# EAGLE design PDU_Meanwell_LRS (EAGLE 9.6.2)
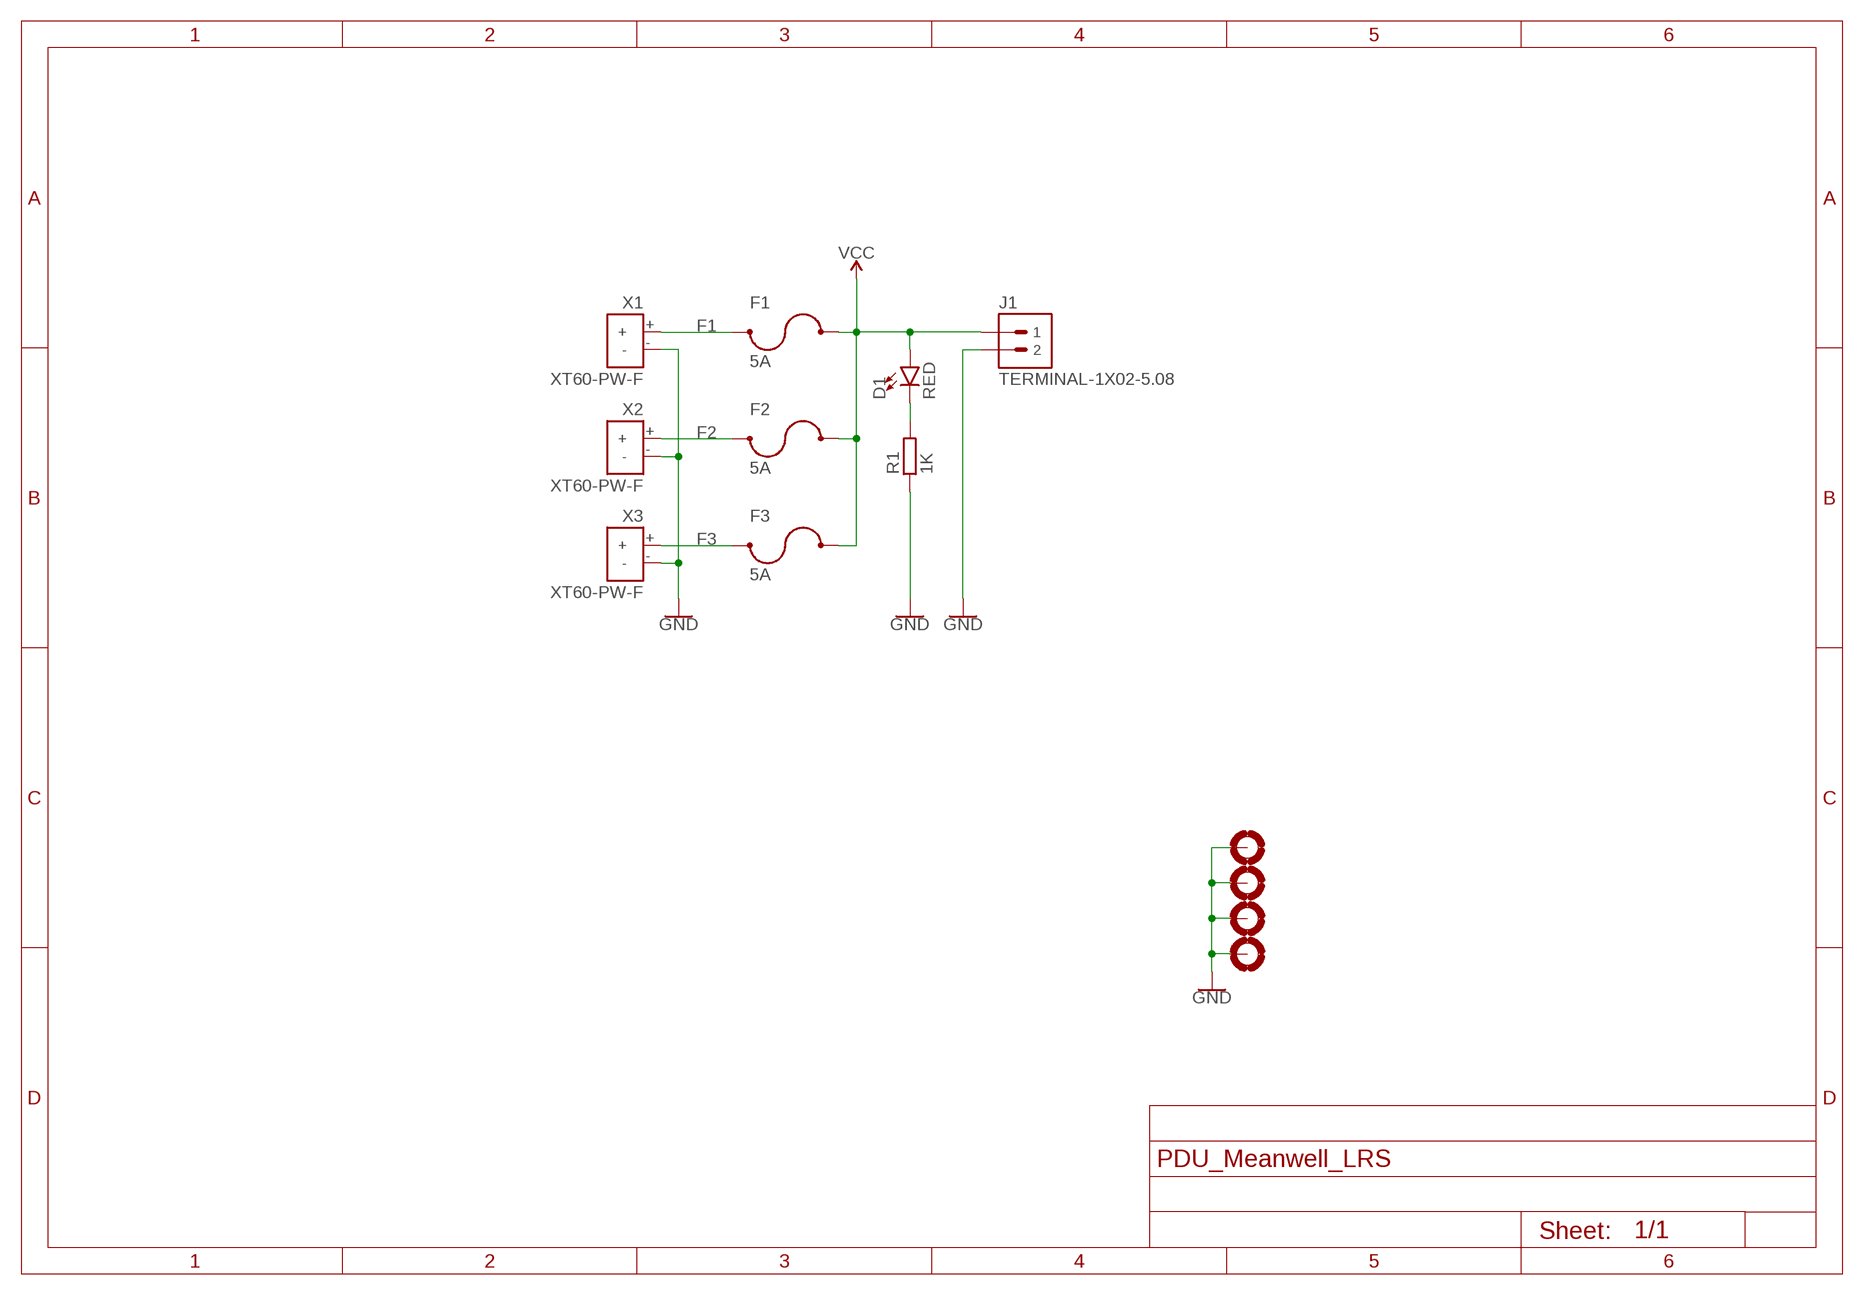
[diagram p0: schematic, sheet 1]

## Parts
D1  RED  LED5MM  [LED5MM]
F1  5A  FUSE-HOLDERCAR-MEDIUM  [CAR-FUSE-MEDIUM]
F2  5A  FUSE-HOLDERCAR-MEDIUM  [CAR-FUSE-MEDIUM]
F3  5A  FUSE-HOLDERCAR-MEDIUM  [CAR-FUSE-MEDIUM]
H1  MOUNTHOLE-PAD3.2  [3.2-PAD]
H2  MOUNTHOLE-PAD3.2  [3.2-PAD]
H3  MOUNTHOLE-PAD3.2  [3.2-PAD]
H4  MOUNTHOLE-PAD3.2  [3.2-PAD]
J1  TERMINAL-1X02-5.08  [TERMINAL-5.08-2P]
R1  1K  RESISTOR0603  [R0603]
X1  XT60-PW-F  [XT60-PW-F]
X2  XT60-PW-F  [XT60-PW-F]
X3  XT60-PW-F  [XT60-PW-F]

## Nets
F1: F1.1@1 F1.1@2 X1.+
F2: F2.1@1 F2.1@2 X2.+
F3: F3.1@1 F3.1@2 X3.+
GND: H1.B3,2(MOUNT) H2.B3,2(MOUNT) H3.B3,2(MOUNT) H4.B3,2(MOUNT) J1.P$2 R1.1 X1.- X2.- X3.-
N$3: D1.K(C) R1.2
VCC: D1.A F1.2@3 F1.2@4 F2.2@3 F2.2@4 F3.2@3 F3.2@4 J1.P$1

## Library data of the parts
D1 = M2M-LED:LED: LED (Generic) Standard schematic elements and footprints for 5mm, 3mm, 1206, and 0603 sized LEDs. Generic LEDs with no color specified.
F1-F3 = M2M-Fuse:FUSE-HOLDER
H1-H4 = M2M-Holes:MOUNTHOLE-PAD
J1 = M2M-Connectors:TERMINAL-1X02-5.08: https://www.digikey.se/product-detail/sv/on-shore-technology-inc/OSTTC022162/ED2609-ND/614558
R1 = M2M-Passives:RESISTOR
X1-X3 = M2M-Connectors:XT60

## Board
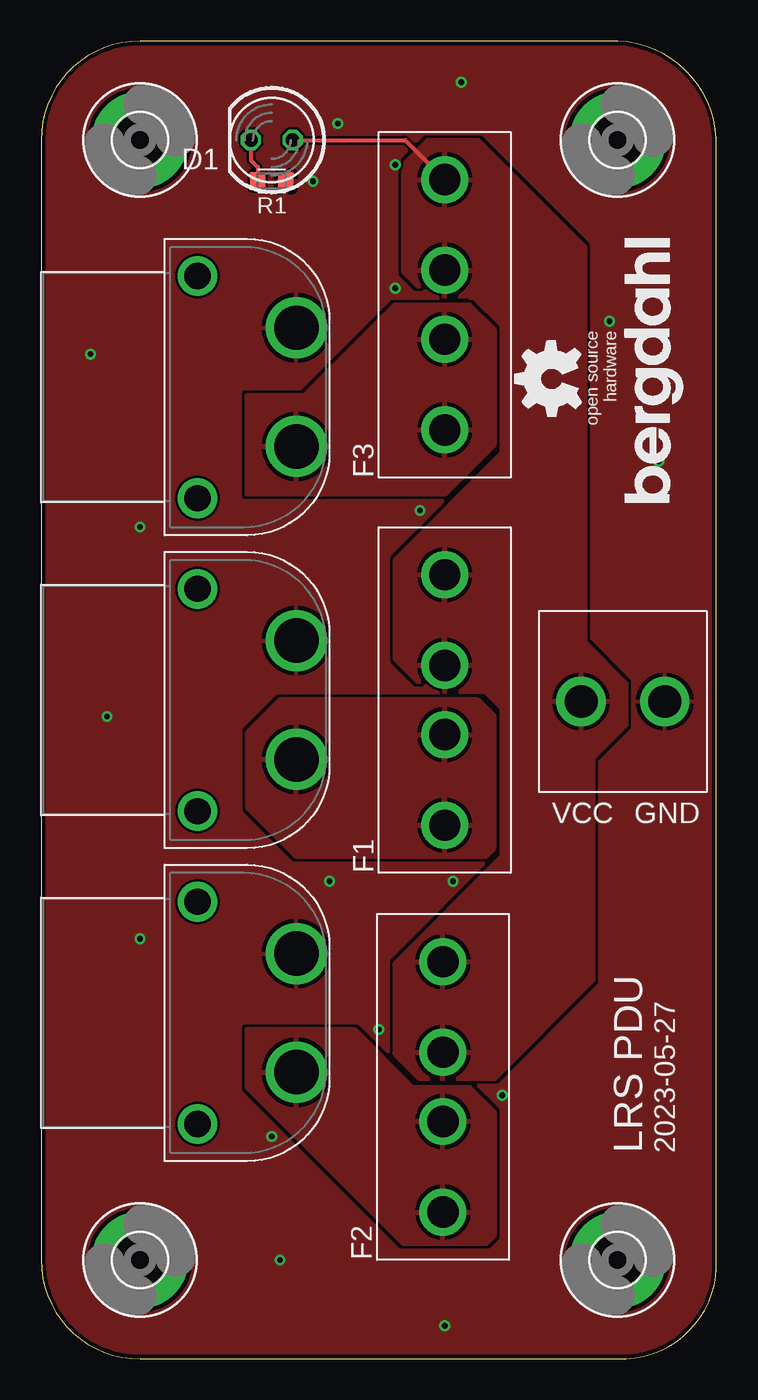
[diagram p1: board, top side]
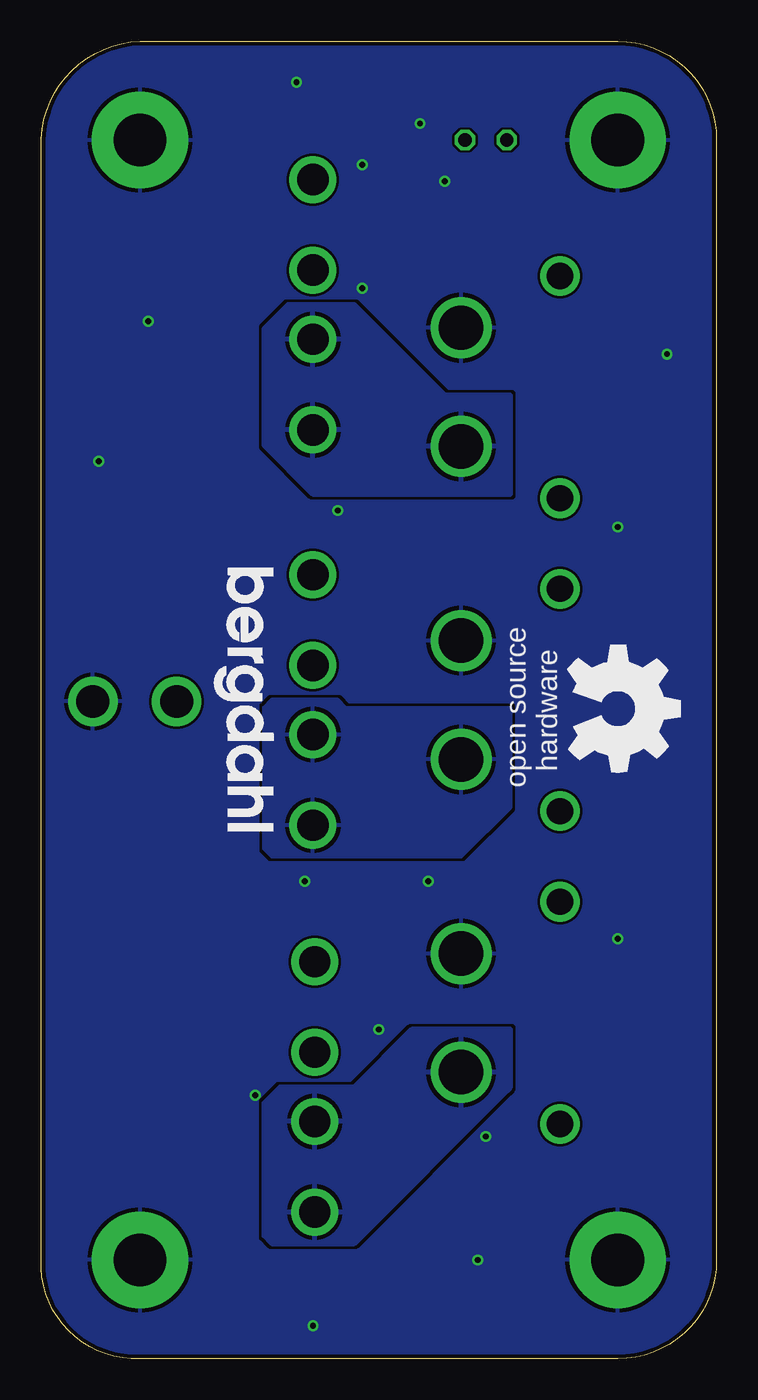
[diagram p2: board, bottom side, seen from below]

Size 41 x 80 mm. Coordinates in mm from the lower left corner, seen from the top.
Outline: 0,74 0,6 arc90 6,0 35,0 arc90 41,5.5 41,73.5 arc90 35,80 6,80 arc90 0,74
Copper layers (1*16): Top 0.035mm / dielectric 1.5mm / Bottom 0.035mm
Design rules "SeeedStudio_2layer_DRU_no_angle_20140221": minimum track width 6mil, minimum drill 0.3mm, track to track 6mil, track to pad 6mil, pad to pad 6mil, via to via 6mil, smd to smd 0mil, copper to edge 10mil, drill to drill 10mil, minimum pad ring 2mil, minimum via ring 6mil, stop-mask expansion 2mil, vias tented up to drill 1000mil, thermal gap 10mil

### Footprints (pad centres in the part's own frame; a part is rotated, then mirrored left to right if it is on the bottom)
LED5MM = drill 0.813 octagon: A -1.27,0; K 1.27,0
CAR-FUSE-MEDIUM = drill 1.9: 1@1 -7.6,0; 1@2 -2.1,0; 2@3 2.1,0; 2@4 7.6,0
3.2-PAD = drill 3.2 pad 5.842: B3,2 0,0
TERMINAL-5.08-2P = drill 2: P$1 -2.54,0; P$2 2.54,0
R0603 = smd 1 x 1.1: 1 -0.85,0; 2 0.85,0
XT60-PW-F = drill 2.7: + -3.6,-6; - 3.6,-6 | drill 1.6: P@1 -6.75,0; P@2 6.75,0

### Placement (x,y rotation side)
D1  14,74 180 top
F1  24.5,40 90 top
F2  24.39,16.51 90 top
F3  24.5,64 90 top
H1  35,6 0 top
H2  35,74 0 top
H3  6,6 0 top
H4  6,74 0 top
J1  35.32,39.91 0 top
R1  14,71.5 180 top
U$1  [BERGDAHL-20MM-TPLACE]  39,52 90 top
U$2  [OSHW-5MM-TPLACE]  31,59.5 90 top
U$3  [BERGDAHL-20MM-BPLACE]  30.5,32 90 top
U$4  [OSHW-8MM-BPLACE]  6,39.5 90 top
X1  9.5,40 90 top
X2  9.5,21 90 top
X3  9.5,59 90 top

### Tracks (layer width: path | path; a pad name or v marks a point on that pad's centre or on a via)
F1
  pour Bottom: 12.5,33.5 12.5,39.5 22.5,39.5 23,40 26.5,40 27,40 27.5,39.5 27.5,31 27,30.5 23.5,30.5 15.5,30.5
  pour Top: 26.5,40 23,40 14.5,40 12.5,38 12.5,33.5 15.5,30.5 27,30.5 27.5,31 27.5,39
F2
  pour Top: 12.5,20 19,20 22.5,16.5 26,16.5 27.5,15 27.5,7.5 27,7 22,7 12.5,16.5
  pour Bottom: 12.5,20 18.5,20 22,16.5 26.5,16.5 27.5,15.5 27.5,7.5 27,7 22,7 13,16 12.5,16.5
F3
  pour Top: 12.5,52.5 12.5,58.5 16,58.5 21.5,64 26,64 27.5,62.5 27.5,55.5 24.5,52.5
  pour Bottom: 12.5,58.5 16.5,58.5 22,64 26,64 27.5,62.5 27.5,55.5 24.5,52.5 12.5,52.5
GND  (via drill 0.35)
  other vias: 16.5,71.5 21.5,65 23,51.5 25,29 20.5,20 28,16 34.5,63 37.5,54.5 3,61 6,50.5 4,39 6,25.5 14,13.5 17.5,29 14.5,6 24.5,2 25.5,77.5 18,75 21.5,72.5
  pour Bottom (rank 6): 0,80 41.5,80 41.5,0 0,0
  pour Top (rank 6): 0,80 41.5,80 41.5,0 0,0
N$3
  Top 0.254: D1.K 12.73,72.77 13.15,72.35 R1.2
VCC
  Top 0.254: D1.A 22.1,74 F3.2@4
  pour Top (rank 2): 22,72.5 23.5,74 26.5,74 33,67.5 33,43.5 35.5,41 35.5,38.5 33.5,36.5 33.5,23 27.5,17 23,17 21.5,18.5 21.5,24 28,30.5 28,39.5 27,40.5 23.5,40.5 21.5,42.5 21.5,48.5 28,55 28,62.5 26,64.5 23.5,64.5 22,66

### Text on the board
tPlace: VCC | GND | LRS PDU | 2023-05-27